# Altium schematic sheet [10] - HDMI FRAMER.SchDoc
size A2; DocumentNumber: 10; SheetNumber: 10; SheetTotal: 13; NameAuthor: Angle Vu
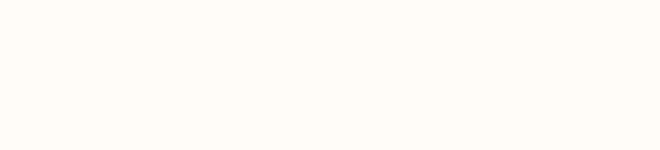
[diagram p0: [10] - HDMI FRAMER.SchDoc]

## Notes on the sheet
- CLOCKS (CPU & PCIE)
- Designed By
- Checked By
- Page Name:
- Size:
- A2
- Company:
- Address:
- Sheet:
- /